# EAGLE design robocon_main_board_2017_rev3 (EAGLE 7.5.0)
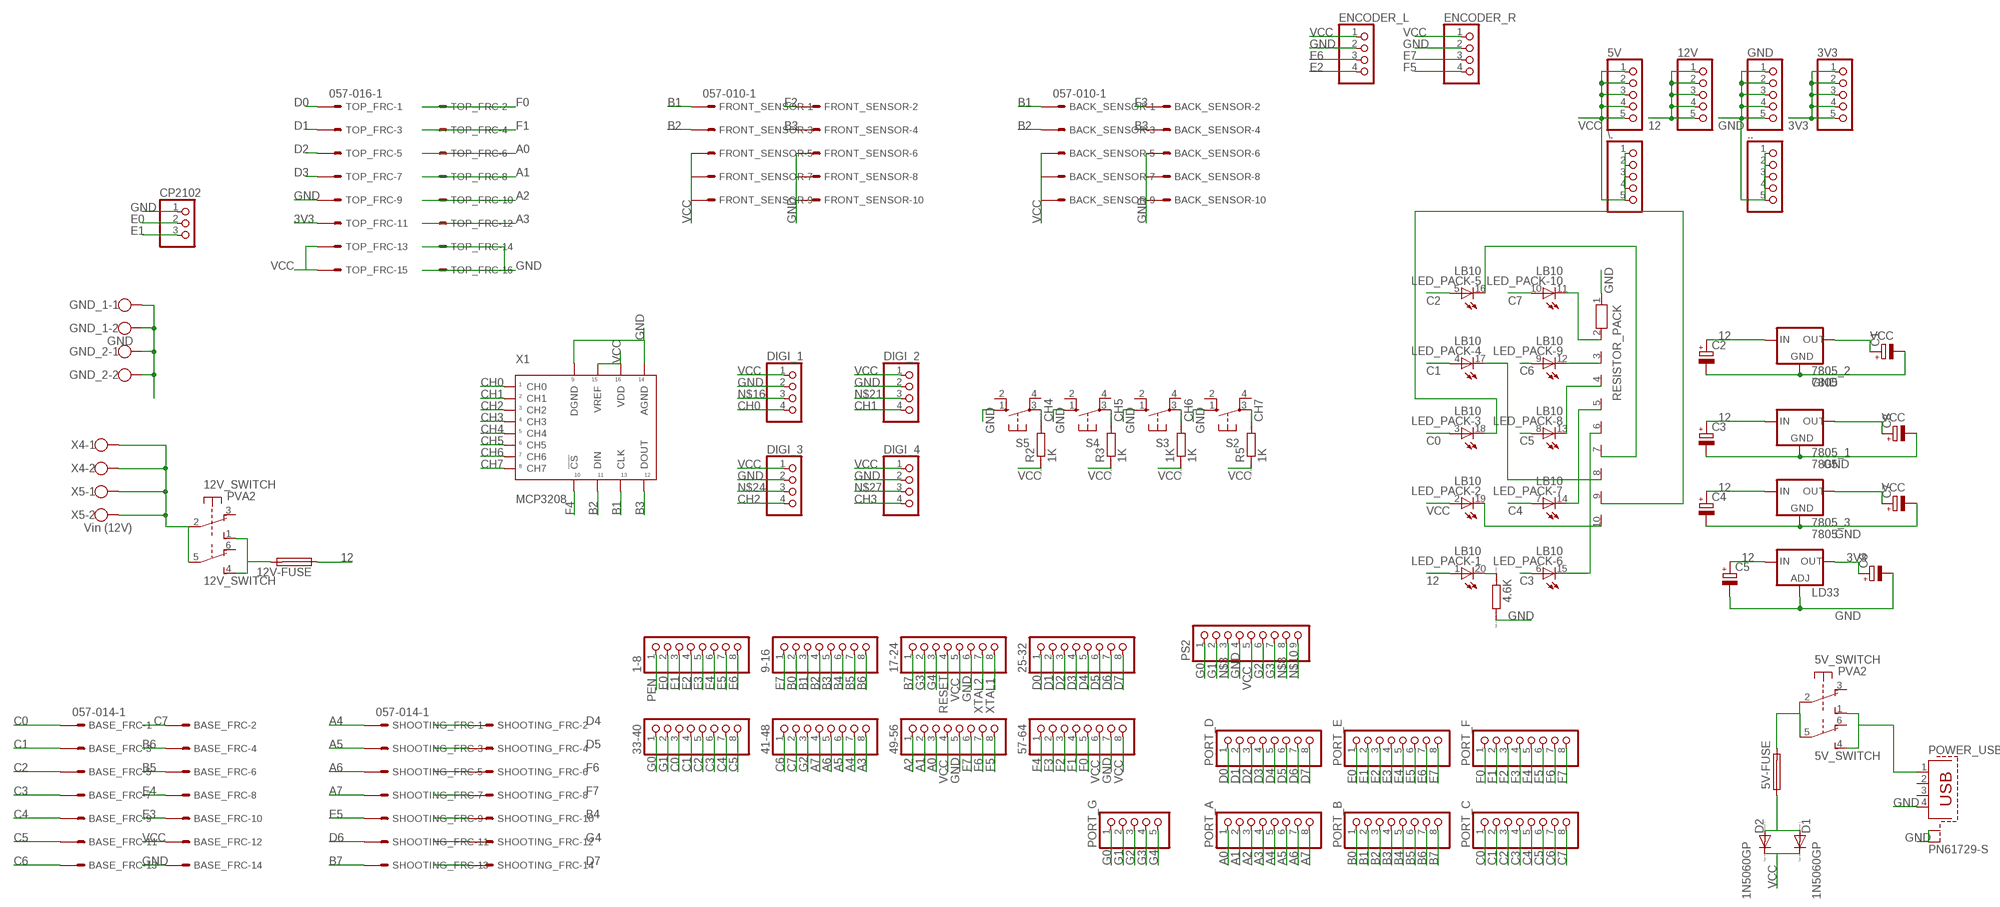
[diagram p0: schematic, sheet 1]

## Parts
1-8  PINHD-1X8  [1X08]
1K  1K  R0204/7  [0204/7]
3V3  PINHD-1X5  [1X05]
4.6K  R0204/7  [0204/7]
5V  PINHD-1X5  [1X05]
5V-FUSE  SH25  [SH25]
5V_SWITCH  PVA2  [PVA2F]
9-16  PINHD-1X8  [1X08]
12V  PINHD-1X5  [1X05]
12V-FUSE  SH25  [SH25]
12V_SWITCH  PVA2  [PVA2F]
17-24  PINHD-1X8  [1X08]
25-32  PINHD-1X8  [1X08]
33-40  PINHD-1X8  [1X08]
41-48  PINHD-1X8  [1X08]
49-56  PINHD-1X8  [1X08]
57-64  PINHD-1X8  [1X08]
7805_1  7805  78XXS  [78XXS]
7805_2  7805  78XXS  [78XXS]
7805_3  7805  78XXS  [78XXS]
..  PINHD-1X5  [1X05]
\.  PINHD-1X5  [1X05]
BACK_SENSOR  057-010-1  [057-010-1]
BASE_FRC  057-014-1  [057-014-1]
C1  CPOL-EUE2.5-5  [E2,5-5]
C2  CPOL-EUE2.5-5  [E2,5-5]
C3  CPOL-EUE2.5-5  [E2,5-5]
C4  CPOL-EUE2.5-5  [E2,5-5]
C5  CPOL-EUE2.5-5  [E2,5-5]
C6  CPOL-EUE2.5-5  [E2,5-5]
C7  CPOL-EUE2.5-5  [E2,5-5]
C8  CPOL-EUE2.5-5  [E2,5-5]
CP2102  PINHD-1X3  [1X03]
D1  1N5060GP  [DO15-12]
D2  1N5060GP  [DO15-12]
DIGI_1  PINHD-1X4  [1X04]
DIGI_2  PINHD-1X4  [1X04]
DIGI_3  PINHD-1X4  [1X04]
DIGI_4  PINHD-1X4  [1X04]
ENCODER_L  PINHD-1X4  [1X04]
ENCODER_R  PINHD-1X4  [1X04]
FRONT_SENSOR  057-010-1  [057-010-1]
GND  PINHD-1X5  [1X05]
GND_1  GND  W237-102  [W237-102]
GND_2  W237-102  [W237-102]
LD33  LM317TS  [317TS]
LED_PACK  LB10  [LB10]
PORT_A  PINHD-1X8  [1X08]
PORT_B  PINHD-1X8  [1X08]
PORT_C  PINHD-1X8  [1X08]
PORT_D  PINHD-1X8  [1X08]
PORT_E  PINHD-1X8  [1X08]
PORT_F  PINHD-1X8  [1X08]
PORT_G  PINHD-1X5  [1X05]
POWER_USB  PN61729-S  [PN61729-S]
PS2  PINHD-1X9  [1X09]
R2  1K  R0204/7  [0204/7]
R3  1K  R0204/7  [0204/7]
R5  1K  R0204/7  [0204/7]
RESISTOR_PACK  RN09  [RN-10]
S2  10-XX  [B3F-10XX]
S3  10-XX  [B3F-10XX]
S4  10-XX  [B3F-10XX]
S5  10-XX  [B3F-10XX]
SHOOTING_FRC  057-014-1  [057-014-1]
TOP_FRC  057-016-1  [057-016-1]
X1  MCP3208  21298EDIP  [DIP16]
X4  W237-102  [W237-102]
X5  Vin (12V)  W237-102  [W237-102]

## Nets
3V3: 3V3.1 3V3.2 3V3.3 3V3.4 3V3.5 C6.+ LD33.2(OUT) TOP_FRC.11
12: 12V-FUSE.1 12V.1 12V.2 12V.3 12V.4 12V.5 7805_1.IN 7805_2.IN 7805_3.IN C2.+ C3.+ C4.+ C5.+ LD33.3(IN) LED_PACK.1(-1:A)
A0: 49-56.3 PORT_A.1 TOP_FRC.6
A1: 49-56.2 PORT_A.2 TOP_FRC.8
A2: 49-56.1 PORT_A.3 TOP_FRC.10
A3: 41-48.8 PORT_A.4 TOP_FRC.12
A4: 41-48.7 PORT_A.5 SHOOTING_FRC.1
A5: 41-48.6 PORT_A.6 SHOOTING_FRC.3
A6: 41-48.5 PORT_A.7 SHOOTING_FRC.5
A7: 41-48.4 PORT_A.8 SHOOTING_FRC.7
B0: 9-16.2 PORT_B.1
B1: 9-16.3 BACK_SENSOR.1 FRONT_SENSOR.1 PORT_B.2 X1.P$13(CLK)
B2: 9-16.4 BACK_SENSOR.3 FRONT_SENSOR.3 PORT_B.3 X1.P$11(DIN)
B3: 9-16.5 BACK_SENSOR.4 FRONT_SENSOR.4 PORT_B.4 X1.P$12(DOUT)
B4: 9-16.6 PORT_B.5 SHOOTING_FRC.10
B5: 9-16.7 BASE_FRC.6 PORT_B.6
B6: 9-16.8 BASE_FRC.4 PORT_B.7
B7: 17-24.1 PORT_B.8 SHOOTING_FRC.13
C0: 33-40.3 BASE_FRC.1 LED_PACK.3(-3:A) PORT_C.1
C1: 33-40.4 BASE_FRC.3 LED_PACK.4(-4:A) PORT_C.2
C2: 33-40.5 BASE_FRC.5 LED_PACK.5(-5:A) PORT_C.3
C3: 33-40.6 BASE_FRC.7 LED_PACK.6(-6:A) PORT_C.4
C4: 33-40.7 BASE_FRC.9 LED_PACK.7(-7:A) PORT_C.5
C5: 33-40.8 BASE_FRC.11 LED_PACK.8(-8:A) PORT_C.6
C6: 41-48.1 BASE_FRC.13 LED_PACK.9(-9:A) PORT_C.7
C7: 41-48.2 BASE_FRC.2 LED_PACK.10(-10:A) PORT_C.8
CH0: DIGI_1.4 X1.P$1(CH0)
CH1: DIGI_2.4 X1.P$2(CH1)
CH2: DIGI_3.4 X1.P$3(CH2)
CH3: DIGI_4.4 X1.P$4(CH3)
CH4: R2.2 S5.3(P) X1.P$5(CH4)
CH5: R3.2 S4.3(P) X1.P$6(CH5)
CH6: 1K.2 S3.3(P) X1.P$7(CH6)
CH7: R5.2 S2.3(P) X1.P$8(CH7)
D0: 25-32.1 PORT_D.1 TOP_FRC.1
D1: 25-32.2 PORT_D.2 TOP_FRC.3
D2: 25-32.3 PORT_D.3 TOP_FRC.5
D3: 25-32.4 PORT_D.4 TOP_FRC.7
D4: 25-32.5 PORT_D.5 SHOOTING_FRC.2
D5: 25-32.6 PORT_D.6 SHOOTING_FRC.4
D6: 25-32.7 PORT_D.7 SHOOTING_FRC.11
D7: 25-32.8 PORT_D.8 SHOOTING_FRC.14
E0: 1-8.2 CP2102.2 PORT_E.1
E1: 1-8.3 CP2102.3 PORT_E.2
E2: 1-8.4 ENCODER_L.4 PORT_E.3
E3: 1-8.5 BASE_FRC.10 PORT_E.4
E4: 1-8.6 BASE_FRC.8 PORT_E.5
E5: 1-8.7 PORT_E.6 SHOOTING_FRC.9
E6: 1-8.8 ENCODER_L.3 PORT_E.7
E7: 9-16.1 ENCODER_R.3 PORT_E.8
F0: 57-64.5 PORT_F.1 TOP_FRC.2
F1: 57-64.4 PORT_F.2 TOP_FRC.4
F2: 57-64.3 FRONT_SENSOR.2 PORT_F.3
F3: 57-64.2 BACK_SENSOR.2 PORT_F.4
F4: 57-64.1 PORT_F.5 X1.P$10(!CS)
F5: 49-56.8 ENCODER_R.4 PORT_F.6
F6: 49-56.7 PORT_F.7 SHOOTING_FRC.6
F7: 49-56.6 PORT_F.8 SHOOTING_FRC.8
G0: 33-40.1 PORT_G.1 PS2.1
G1: 33-40.2 PORT_G.2 PS2.2
G2: 41-48.3 PORT_G.3 PS2.6
G3: 17-24.2 PORT_G.4 PS2.7
G4: 17-24.3 PORT_G.5 SHOOTING_FRC.12
GND: 4.6K.2 17-24.6 49-56.5 57-64.7 7805_1.GND 7805_2.GND 7805_3.GND ...1 ...2 ...3 ...4 ...5 BACK_SENSOR.6 BACK_SENSOR.8 BACK_SENSOR.10 BASE_FRC.14 C1.- C2.- C3.- C4.- C5.- C6.- C7.- C8.- CP2102.1 DIGI_1.2 DIGI_2.2 DIGI_3.2 DIGI_4.2 ENCODER_L.2 ENCODER_R.2 FRONT_SENSOR.6 FRONT_SENSOR.8 FRONT_SENSOR.10 GND.1 GND.2 GND.3 GND.4 GND.5 GND_1.1 GND_1.2 GND_2.1 GND_2.2 LD33.1(ADJ) POWER_USB.4 POWER_USB.S1 POWER_USB.S2 PS2.4 RESISTOR_PACK.1 S2.1(S) S3.1(S) S4.1(S) S5.1(S) TOP_FRC.9 TOP_FRC.14 TOP_FRC.16 X1.P$9(DGND) X1.P$14(AGND)
N$1: LED_PACK.11(-10:C) RESISTOR_PACK.2
N$2: LED_PACK.12(-9:C) RESISTOR_PACK.3
N$3: PS2.3
N$4: LED_PACK.13(-8:C) RESISTOR_PACK.4
N$5: LED_PACK.14(-7:C) RESISTOR_PACK.5
N$6: LED_PACK.15(-6:C) RESISTOR_PACK.6
N$7: LED_PACK.16(-5:C) RESISTOR_PACK.7
N$8: PS2.8
N$9: LED_PACK.17(-4:C) RESISTOR_PACK.8
N$10: PS2.9
N$11: LED_PACK.18(-3:C) RESISTOR_PACK.9
N$12: LED_PACK.19(-2:C) RESISTOR_PACK.10
N$13: 4.6K.1 LED_PACK.20(-1:C)
N$14: 5V_SWITCH.1(1:S) 5V_SWITCH.4(2:S) POWER_USB.1
N$15: 5V-FUSE.2 5V_SWITCH.2(1:P) 5V_SWITCH.5(2:P)
N$16: DIGI_1.3
N$17: 12V_SWITCH.2(1:P) 12V_SWITCH.5(2:P) X4.1 X4.2 X5.1 X5.2
N$18: 12V-FUSE.2 12V_SWITCH.1(1:S) 12V_SWITCH.4(2:S)
N$19: 5V-FUSE.1 D1.A D2.A
N$21: DIGI_2.3
N$24: DIGI_3.3
N$27: DIGI_4.3
PEN: 1-8.1
RESET: 17-24.4
VCC: 1K.1 5V.1 5V.2 5V.3 5V.4 5V.5 17-24.5 49-56.4 57-64.6 57-64.8 7805_1.OUT 7805_2.OUT 7805_3.OUT \..1 \..2 \..3 \..4 \..5 BACK_SENSOR.5 BACK_SENSOR.7 BACK_SENSOR.9 BASE_FRC.12 C1.+ C7.+ C8.+ D1.C D2.C DIGI_1.1 DIGI_2.1 DIGI_3.1 DIGI_4.1 ENCODER_L.1 ENCODER_R.1 FRONT_SENSOR.5 FRONT_SENSOR.7 FRONT_SENSOR.9 LED_PACK.2(-2:A) PS2.5 R2.1 R3.1 R5.1 TOP_FRC.13 TOP_FRC.15 X1.P$15(VREF) X1.P$16(VDD)
XTAL1: 17-24.8
XTAL2: 17-24.7
Unconnected: 5V_SWITCH.3(1:O) 5V_SWITCH.6(2:O) 12V_SWITCH.3(1:O) 12V_SWITCH.6(2:O) POWER_USB.2 POWER_USB.3 S2.2(S1) S2.4(P1) S3.2(S1) S3.4(P1) S4.2(S1) S4.4(P1) S5.2(S1) S5.4(P1)

## Library data of the parts
1-8 9-16 17-24 25-32 33-40 41-48 49-56 57-64 PORT_A PORT_B PORT_C PORT_D PORT_E PORT_F = pinhead:PINHD-1X8: PIN HEADER
1K 4.6K R2 R3 R5 = eagle-ltspice:R: RESISTOR, European symbol; SPICEMODEL: NONE; SPICEPREFIX: R
3V3 5V 12V .. \. GND PORT_G = pinhead:PINHD-1X5: PIN HEADER
5V-FUSE 12V-FUSE = fuse:SH25: FUSE HOLDER grid 25 mm, OGN0031 8211, Schurter (Buerklin); MF: SCHURTER; MPN: 0031.8211; OC_FARNELL: 1162741; OC_NEWARK: 96B9380
5V_SWITCH 12V_SWITCH = switch-misc:PVA2: ITT SWITCH
7805_1-7805_3 = v-reg:78XXS: VOLTAGE REGULATOR
BACK_SENSOR FRONT_SENSOR = con-panduit:057-010-: CONNECTOR 10-pin series 057 contact pc board low profile headers; OC_FARNELL: unknown; OC_NEWARK: unknown
BASE_FRC SHOOTING_FRC = con-panduit:057-014-: CONNECTOR 10-pin series 057 contact pc board low profile headers; OC_FARNELL: unknown; OC_NEWARK: unknown
C1-C8 = rcl:CPOL-EU: POLARIZED CAPACITOR, European symbol
CP2102 = pinhead:PINHD-1X3: PIN HEADER
D1 D2 = diode:1N5060GP: DIODE controlled avalanche rectifier
DIGI_1-DIGI_4 ENCODER_L ENCODER_R = pinhead:PINHD-1X4: PIN HEADER
GND_1 GND_2 X4 X5 = con-wago-500:W237-102: WAGO SCREW CLAMP; MPN: 237-102; OC_FARNELL: unknown; OC_NEWARK: 70K9898
LD33 = v-reg:LM317TS: VOLTAGE REGULATOR
LED_PACK = led:LB10: LED BLOCK 10-LED bar graph, DIL, Siemens
POWER_USB = con-berg:PN61729-S: BERG USB connector; OC_FARNELL: unknown; OC_NEWARK: unknown
PS2 = pinhead:PINHD-1X9: PIN HEADER
RESISTOR_PACK = resistor-net:RN09: RESISTOR NETWORK; OC_FARNELL: unknown; OC_NEWARK: unknown
S2-S5 = switch-omron:10-XX: OMRON SWITCH; MPN: B3F-1000; OC_FARNELL: 176432; OC_NEWARK: 36M3542
TOP_FRC = con-panduit:057-016-: CONNECTOR 10-pin series 057 contact pc board low profile headers; OC_FARNELL: unknown; OC_NEWARK: unknown
X1 = Microchip:21298E

## Board
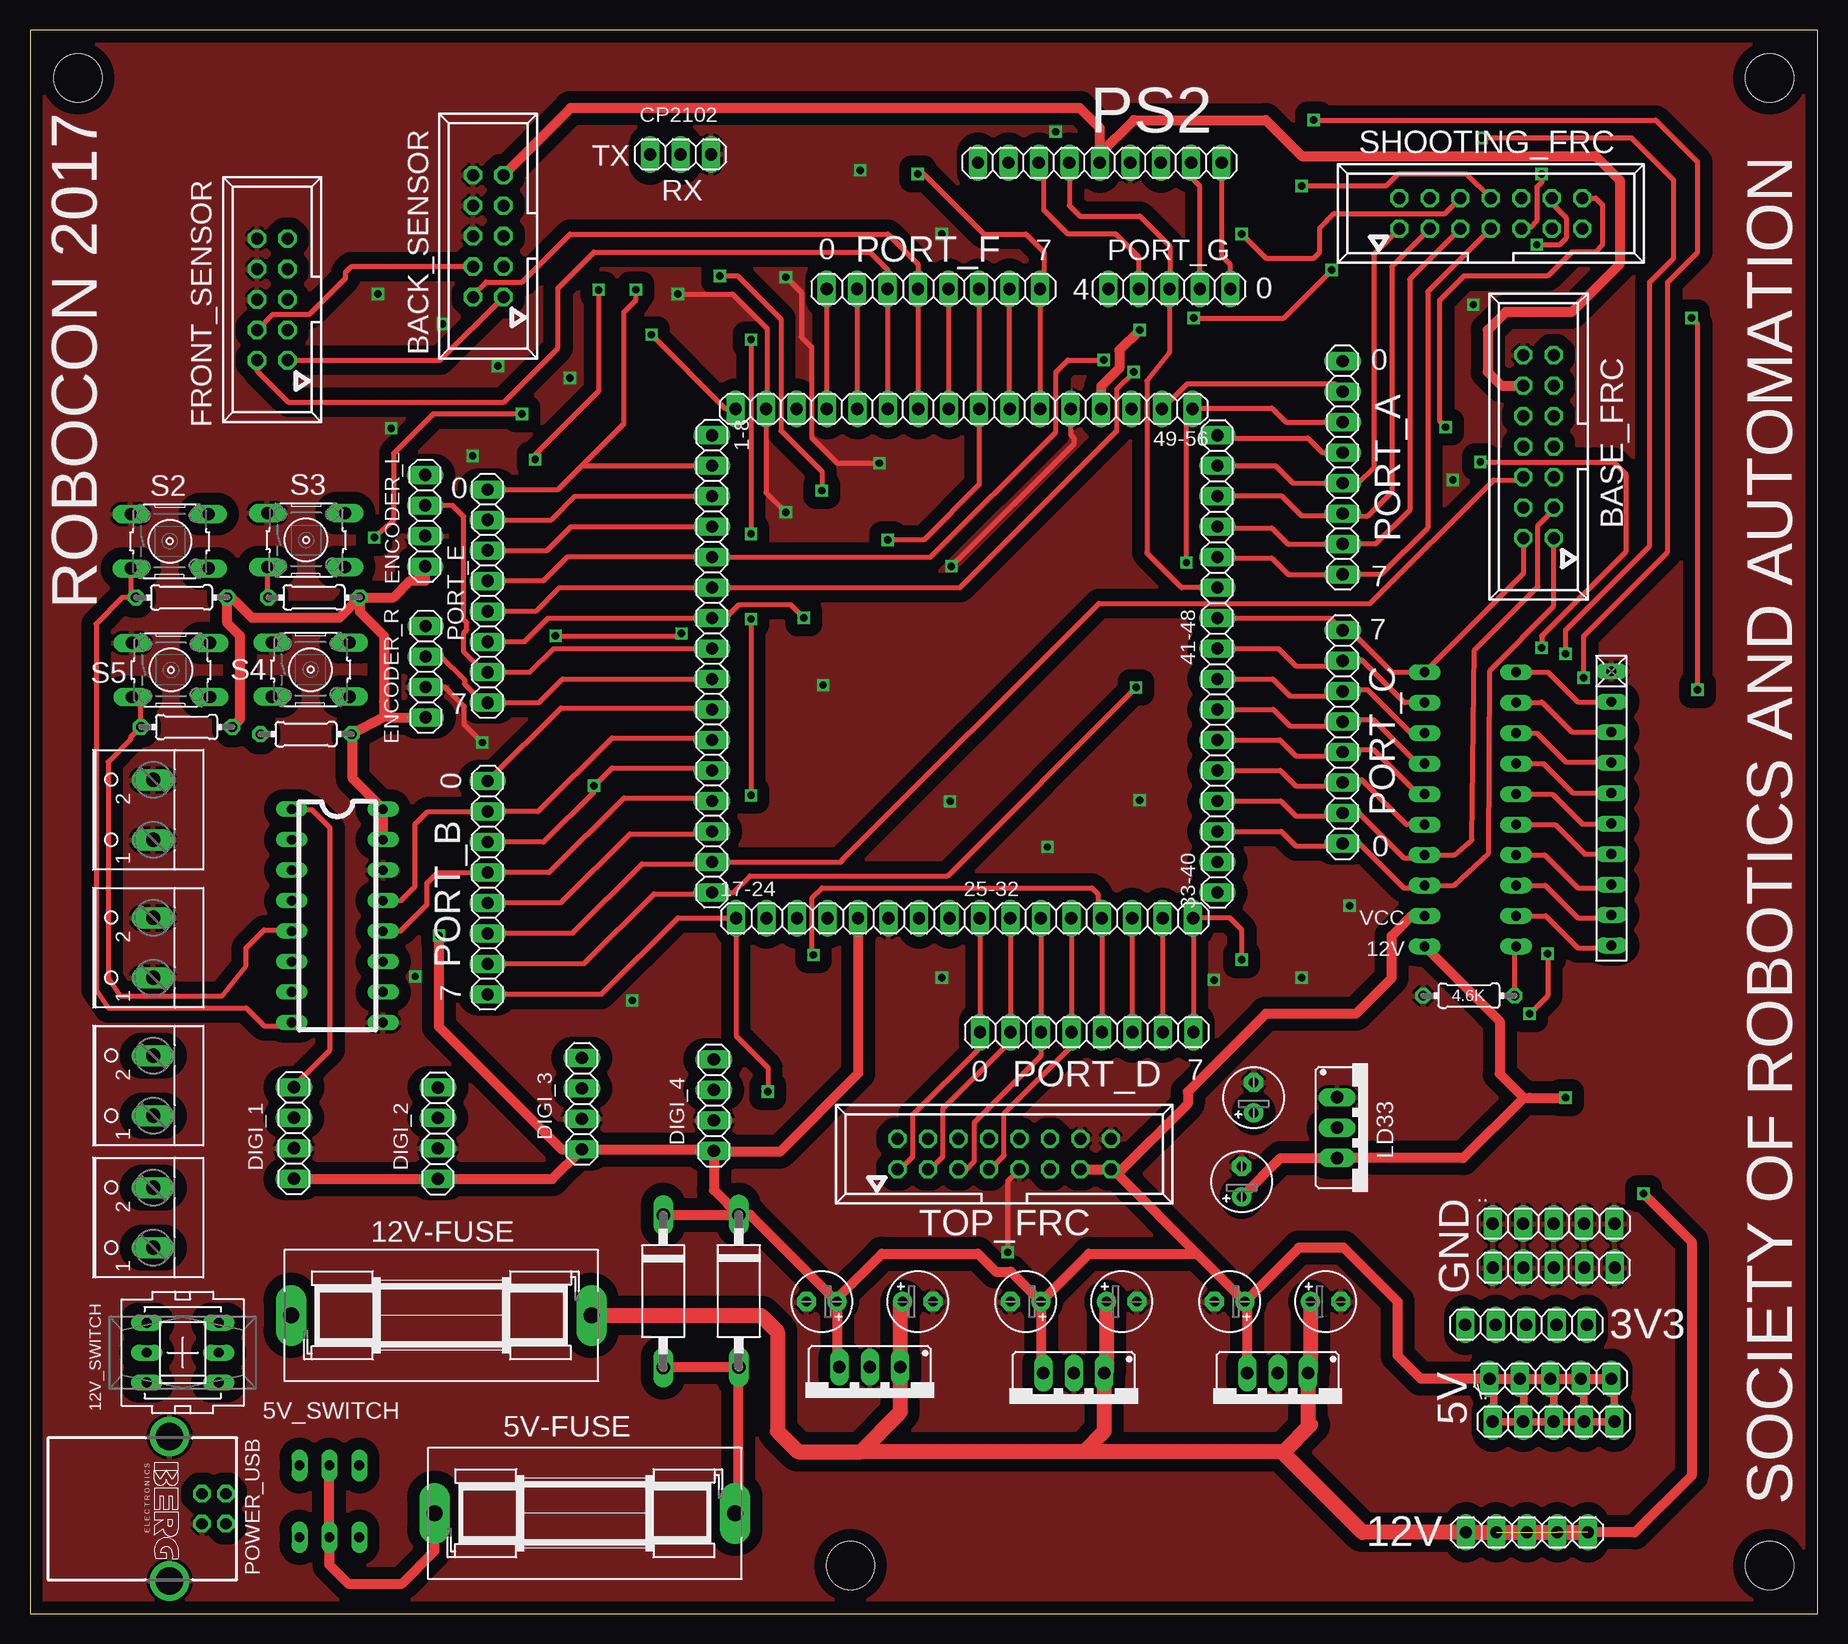
[diagram p1: board, top side]
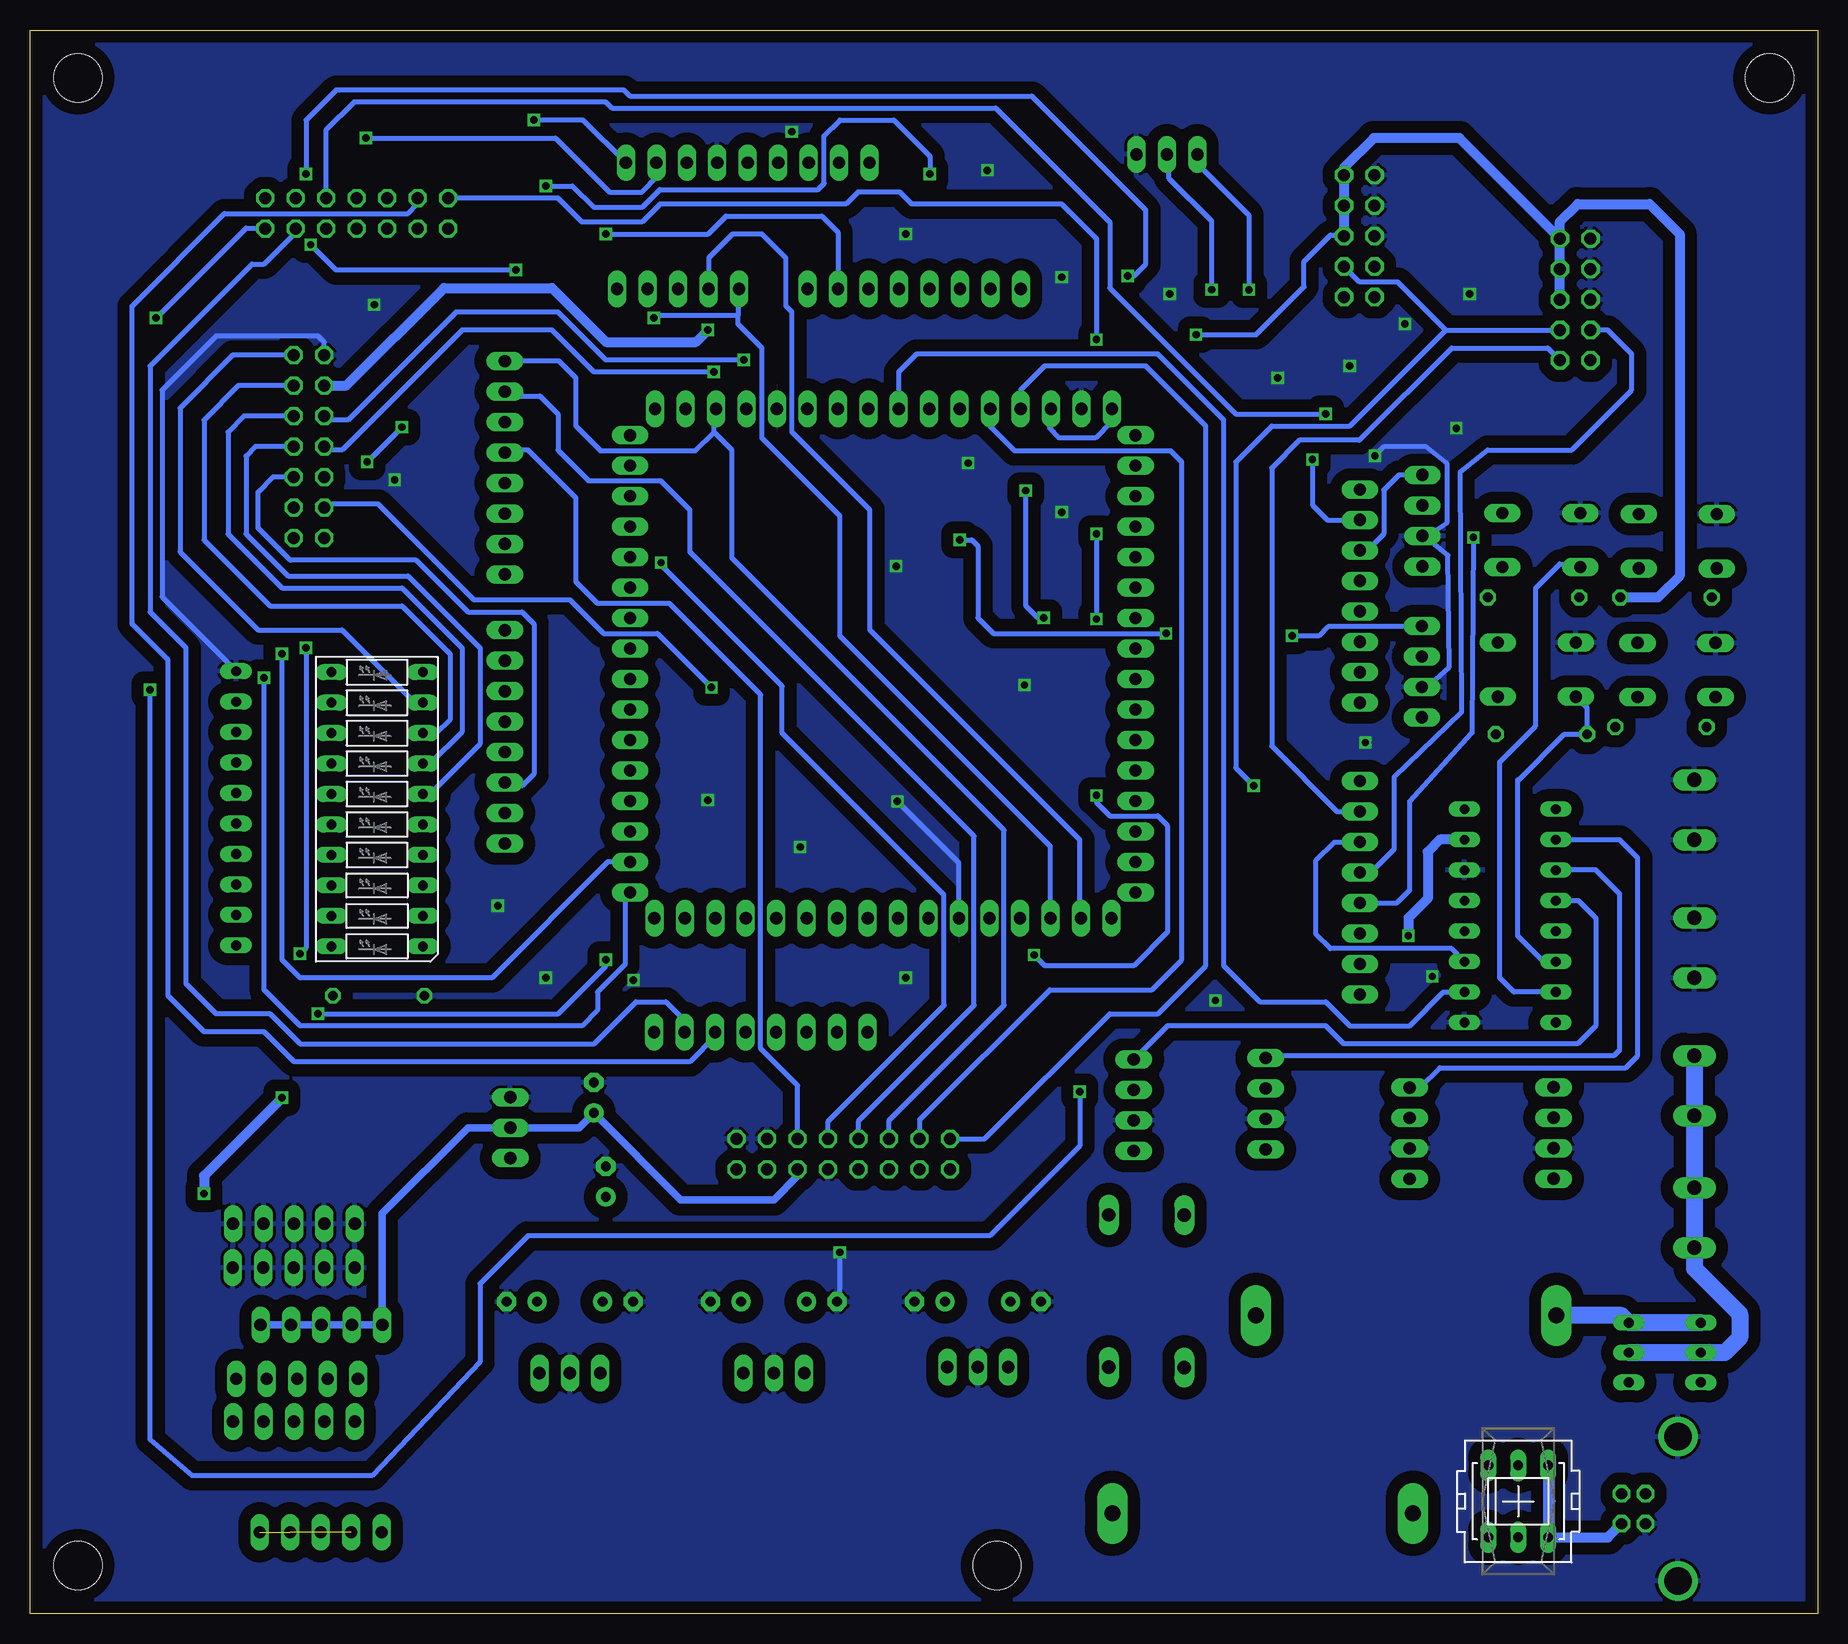
[diagram p2: board, bottom side, seen from below]

Size 149 x 132 mm. Coordinates in mm from the lower left corner, seen from the top.
Outline: 0,132 0,0 149,0 149,132 0,132
Copper layers (1*16): Top 0.035mm / dielectric 1.5mm / Bottom 0.035mm
Design rules "default *": minimum track width 10mil, minimum drill 24mil, track to track 16mil, track to pad 10mil, pad to pad 12mil, via to via 10mil, smd to smd 8mil, copper to edge 40mil, drill to drill 8mil, minimum pad ring 10mil, minimum via ring 8mil, stop-mask expansion 4mil, vias tented up to drill 0mil, thermal gap 10mil
Holes 4 mm at 145,4 145,128 4,128 68.4,4

### Footprints (pad centres in the part's own frame; a part is rotated, then mirrored left to right if it is on the bottom)
1X08 = drill 1.016 long: 1 -8.89,0; 2 -6.35,0; 3 -3.81,0; 4 -1.27,0; 5 1.27,0; 6 3.81,0; 7 6.35,0; 8 8.89,0
0204/7 = drill 0.813 octagon: 1 -3.81,0; 2 3.81,0
1X05 = drill 1.016 long: 1 -5.08,0; 2 -2.54,0; 3 0,0; 4 2.54,0; 5 5.08,0
SH25 = drill 1.321 pad 2.54 long: 1 -12.522,0; 2 12.522,0
PVA2F = drill 0.813 long: 1 -2.997,2.489; 2 -2.997,0; 3 -2.997,-2.489; 4 2.997,2.489; 5 2.997,0; 6 2.997,-2.489
78XXS = drill 1.016 long: GND 0,-2.54; IN -2.54,-2.54; OUT 2.54,-2.54
057-010-1 = drill 1 octagon: 1 -5.08,-1.27; 2 -5.08,1.27; 3 -2.54,-1.27; 4 -2.54,1.27; 5 0,-1.27; 6 0,1.27; 7 2.54,-1.27; 8 2.54,1.27; 9 5.08,-1.27; 10 5.08,1.27
057-014-1 = drill 1 octagon: 1 -7.62,-1.27; 2 -7.62,1.27; 3 -5.08,-1.27; 4 -5.08,1.27; 5 -2.54,-1.27; 6 -2.54,1.27; 7 0,-1.27; 8 0,1.27; 9 2.54,-1.27; 10 2.54,1.27; 11 5.08,-1.27; 12 5.08,1.27; 13 7.62,-1.27; 14 7.62,1.27
E2,5-5 = drill 0.813 pad 1.6: + -1.27,0 | drill 0.813 pad 1.6 octagon: - 1.27,0
1X03 = drill 1.016 long: 1 -2.54,0; 2 0,0; 3 2.54,0
DO15-12 = drill 1.118 long: A 6.35,0; C -6.35,0
1X04 = drill 1.016 long: 1 -3.81,0; 2 -1.27,0; 3 1.27,0; 4 3.81,0
W237-102 = drill 1.194 long: 1 -2.5,-1.27; 2 2.5,-1.27
317TS = drill 1.016 long: 1 -2.54,-2.54; 2 0,-2.54; 3 2.54,-2.54
LB10 = drill 0.813 long: 1 -11.43,-3.81; 2 -8.89,-3.81; 3 -6.35,-3.81; 4 -3.81,-3.81; 5 -1.27,-3.81; 6 1.27,-3.81; 7 3.81,-3.81; 8 6.35,-3.81; 9 8.89,-3.81; 10 11.43,-3.81; 11 11.43,3.81; 12 8.89,3.81; 13 6.35,3.81; 14 3.81,3.81; 15 1.27,3.81; 16 -1.27,3.81; 17 -3.81,3.81; 18 -6.35,3.81; 19 -8.89,3.81; 20 -11.43,3.81
PN61729-S = drill 0.95 octagon: 1 1.25,4.71; 2 -1.25,4.71; 3 -1.25,2.71; 4 1.25,2.71 | drill 2.3 pad 2.9: S1 -6.02,0; S2 6.02,0
1X09 = drill 1.016 long: 1 -10.16,0; 2 -7.62,0; 3 -5.08,0; 4 -2.54,0; 5 0,0; 6 2.54,0; 7 5.08,0; 8 7.62,0; 9 10.16,0
RN-10 = drill 0.813 long: 1 -11.43,0; 2 -8.89,0; 3 -6.35,0; 4 -3.81,0; 5 -1.27,0; 6 1.27,0; 7 3.81,0; 8 6.35,0; 9 8.89,0; 10 11.43,0
B3F-10XX = drill 1.016 long: 1 -3.251,2.261; 2 3.251,2.261; 3 -3.251,-2.261; 4 3.251,-2.261
057-016-1 = drill 1 octagon: 1 -8.89,-1.27; 2 -8.89,1.27; 3 -6.35,-1.27; 4 -6.35,1.27; 5 -3.81,-1.27; 6 -3.81,1.27; 7 -1.27,-1.27; 8 -1.27,1.27; 9 1.27,-1.27; 10 1.27,1.27; 11 3.81,-1.27; 12 3.81,1.27; 13 6.35,-1.27; 14 6.35,1.27; 15 8.89,-1.27; 16 8.89,1.27
DIP16 = drill 0.8 long: P$1 -10.16,-3.81; P$2 -7.62,-3.81; P$3 -5.08,-3.81; P$4 -2.54,-3.81; P$5 0,-3.81; P$6 2.54,-3.81; P$7 5.08,-3.81; P$8 7.62,-3.81; P$9 7.62,3.81; P$10 5.08,3.81; P$11 2.54,3.81; P$12 0,3.81; P$13 -2.54,3.81; P$14 -5.08,3.81; P$15 -7.62,3.81; P$16 -10.16,3.81

### Placement (x,y rotation side)
1-8  56.84,89.33 270 top
1K  23.67,84.7 180 top
3V3  124.71,24.07 0 top
4.6K  119.94,51.5 180 top
5V  126.74,19.57 0 top
5V-FUSE  46.25,8.35 180 top
5V_SWITCH  24.95,9.35 270 bottom
9-16  56.84,69.01 270 top
12V  124.77,6.77 0 top
12V-FUSE  34.29,24.85 180 top
12V_SWITCH  12.73,21.75 0 top
17-24  67.75,57.96 0 top
25-32  88.06,57.96 0 top
33-40  98.97,69.01 90 top
41-48  98.97,89.33 90 top
49-56  88.01,100.42 180 top
57-64  67.69,100.42 180 top
7805_1  70,18 180 top
7805_2  87,17.5 180 top
7805_3  104,17.5 180 top
..  127,32.5 0 top
\.  127,16 0 top
BACK_SENSOR  38.19,114.83 90 top
BASE_FRC  125.74,97.28 90 top
C1  66,26 180 top
C2  74,26 0 top
C3  101,36 90 top
C4  91,26 0 top
C5  108,26 0 top
C6  102,43 90 top
C7  100,26 180 top
C8  83,26 180 top
CP2102  54.23,121.63 180 top
D1  59.08,26.88 270 top
D2  52.78,26.86 270 top
DIGI_1  22,40.06 90 top
DIGI_2  34,40.03 90 top
DIGI_3  46,42.5 90 top
DIGI_4  57,42.37 90 top
ENCODER_L  32.93,91.1 90 top
ENCODER_R  32.98,78.51 90 top
FRONT_SENSOR  20.19,109.54 90 top
GND  127.02,28.83 180 top
GND_1  9,67 90 top
GND_2  9,55.5 90 top
LD33  111.5,40.5 270 top
LED_PACK  120.07,67.04 90 bottom
PORT_A  109.42,95.51 270 top
PORT_B  38.14,60.5 270 top
PORT_C  109.42,73.07 90 top
PORT_D  88.08,48.46 0 top
PORT_E  38.14,84.81 270 top
PORT_F  75.3,110.42 0 top
PORT_G  94.97,110.41 180 top
POWER_USB  11.63,8.73 270 top
PS2  89.17,120.93 180 top
R2  13.05,73.9 180 top
R3  23.01,73.3 180 top
R5  12.63,84.7 180 top
RESISTOR_PACK  131.82,67.12 270 top
S2  11.65,89.38 0 top
S3  23.02,89.48 0 top
S4  23.39,78.68 0 top
S5  11.75,78.65 0 top
SHOOTING_FRC  121.76,116.71 0 top
TOP_FRC  81.2,38.3 0 top
X1  25.62,56.89 270 top
X4  9,44 90 top
X5  9,33 90 top

### Tracks (layer width: path | path; a pad name or v marks a point on that pad's centre or on a via)
3V3
  Bottom 0.61: 3V3.5 3V3.4 3V3.3 3V3.2 3V3.1 119.63,33.37 112.5,40.5 LD33.2 103.23,40.5 C6.+ 94.77,34.5 87,34.5 85.01,36.49 TOP_FRC.11
12  (via drill 0.6)  (3 unrouted)
  Top 0.813: LED_PACK.1 122.5,49.37 122.5,45 124.5,43 | v128,43 125,43 124.5,43 | v134.5,35 138.5,31 138.5,11.5 133.77,6.77 12V.5 | C3.+ 104.23,37.96 LD33.3 119.46,37.96 124.5,43
  Top 1.27: 12V-FUSE.1 60.95,24.85 62.3,23.5 62.3,15.2 64,13.5 69.25,13.5 | 69.25,13.5 72.54,16.79 7805_1.IN 72.54,26 C2.+ | 87.85,13.5 89.54,15.19 7805_2.IN 89.73,20.23 C4.+ | 87.85,13.5 69.25,13.5 | 104.35,13.5 104.5,13.5 106.74,15.74 106.54,15.94 7805_3.IN 106.73,20.23 C5.+ arc-45 106.74,25.98 | 104.35,13.5 87.85,13.5 | 104.35,13.5 111.08,6.77 12V.1 12V.5
  Bottom 0.813: v128,43 134.5,36.5 v134.5,35
A0
  Bottom 0.406: 92,98.5 93.6,96.9 101.4,96.9 103.5,99 103.5,103 104.9,104.4 PORT_A.1 | 92,98.5 92,100.24 49-56.3 | TOP_FRC.6 77.39,41.11 67.8,50.7 67.8,65.3 90.5,88 90.5,97 92,98.5
A1
  Top 0.406: 49-56.2 96.45,102.5 108.78,102.5 PORT_A.2
  Bottom 0.406: TOP_FRC.8 79.93,41.07 70.3,50.7 70.3,64.8 94,88.5 94,92 96.4,94.4 102.4,94.4 105,97 105,100 106.5,101.5 109,101.5 109.36,101.86 PORT_A.2
A2  (via drill 0.6)
  Top 0.406: v96.4,87.6 96.4,99.91 49-56.1 96.99,100.5 103.5,100.5 104.68,99.32 PORT_A.3
  Bottom 0.406: TOP_FRC.10 82.47,41.03 72.8,50.7 72.83,50.73 72.83,59.91 86.3,73.38 86.3,77.3 96.4,87.4 v96.4,87.6
A3
  Top 0.406: 41-48.8 99.19,98 106.5,98 107.72,96.78 PORT_A.4
  Bottom 0.406: TOP_FRC.12 85.01,44.01 88.1,47.1 88.1,76.6 95.7,84.2 101.7,84.2 103.5,86 103.5,93 107.5,97 109.2,97 PORT_A.4
A4
  Top 0.406: 41-48.7 103.82,95.68 105.26,94.24 PORT_A.5 110.74,94.24 112,95.5 112,113.3 SHOOTING_FRC.1
A5
  Top 0.406: SHOOTING_FRC.3 113.5,112.26 113.5,93.5 111.5,91.5 109.62,91.5 PORT_A.6 109.22,91.5 106,91.5 104.36,93.14 41-48.6
A6
  Top 0.406: SHOOTING_FRC.5 115,111.22 115,92 112.16,89.16 PORT_A.7 104.84,89.16 103.5,90.5 99.07,90.5 41-48.5
A7
  Top 0.406: SHOOTING_FRC.7 116.5,110.18 116.5,90.5 112.62,86.62 PORT_A.8 104.88,86.62 103.5,88 99.03,88 41-48.4
B0
  Top 0.406: 9-16.2 56.7,75.5 44.25,75.5 PORT_B.1
B1
  Top 0.406: X1.P$13 30.93,59.43 32.1,60.6 32.1,65.8 33.15,66.85 PORT_B.2 42.35,66.85 48.5,73 56.66,73 9-16.3 | FRONT_SENSOR.1 34.17,104.46 BACK_SENSOR.1
  Bottom 0.406: FRONT_SENSOR.1 22.5,105.5 30.5,105.5 38.2,97.8 43.2,97.8 45.5,95.5 45.5,72.3 40.05,66.85 PORT_B.2
B2  (via drill 0.6)
  Top 0.406: 9-16.4 56.62,70.5 48.5,70.5 v47,69 47,68.5 42.81,64.31 PORT_B.3
  Bottom 0.406: 31,107 39,99 45.5,99 48.5,96 48.5,70.5 v47,69 | 31,107 FRONT_SENSOR.3 | 31,107 35,111 38.17,111 BACK_SENSOR.3 | X1.P$11 30.5,55.42 40.62,55.42 41.8,56.6 41.8,62.8 40.29,64.31 PORT_B.3
B3
  Top 0.406: 9-16.5 56.58,68 49.5,68 43.27,61.77 PORT_B.4 33.97,61.77 33.1,60.9 33.1,59.1 30.89,56.89 X1.P$12 | BACK_SENSOR.4 26.79,112.29 26.3,111.8 26.3,111.3 23.3,108.3 20.22,108.3 FRONT_SENSOR.4
  Bottom 0.406: FRONT_SENSOR.4 17.5,107 15.5,105 15.5,102 20.5,97 27.5,97 29.8,95.12 29.7,75.1 35.3,69.7 35.3,63.7 37.23,61.77 PORT_B.4
B4  (via drill 0.6)
  Top 0.406: 9-16.6 56.65,65 50,65 44.23,59.23 PORT_B.5 | v41,100 33.6,100 30.3,96.7 30.3,91.1 v28.7,89.7
  Bottom 0.406: SHOOTING_FRC.10 124.3,123.7 122,126 101,126 100.5,125.5 68.5,125.5 59,116 59,110.5 48.5,100 v41,100 | PORT_B.5 35.07,59.23 34,60.3 34,67.7 28.8,73.4 v28.7,89.7
B5
  Top 0.406: BASE_FRC.6 124.23,94.5 122,94.5 111.7,84.2 89.1,84.2 67.66,62.76 67.66,62.66 9-16.7 56.69,62.5 51,62.5 45.19,56.69 PORT_B.6
B6  (via drill 0.6)
  Top 0.406: v92.2,77.2 76.5,61.5 60,61.5 58.62,60.12 9-16.8 56.73,60 52,60 46.15,54.15 PORT_B.7
  Bottom 0.406: BASE_FRC.4 124.17,92.5 120,92.5 112,84.5 104,84.5 101.2,81.7 96.7,81.7 v92.2,77.2
B7  (via drill 0.6)
  Top 0.406: v61.5,43.5 61.5,45.5 58.86,48.14 17-24.1 58.82,58 54,58 47.61,51.61 PORT_B.8 | v139,77 139,107.5 v138.5,108
  Bottom 0.406: v61.5,43.5 61.5,39 69,31.5 107.5,31.5 111.5,27.5 111.5,21 120.5,11.5 135.5,11.5 139,14.5 v139,77 | v138.5,108 131,115.5 129.44,115.5 SHOOTING_FRC.13
C0
  Top 0.406: 33-40.3 104.3,65.2 105.5,64 109.24,64 PORT_C.1 110.82,64.18 114.5,60.5 116.07,60.5 LED_PACK.3 118.69,60.69 121.6,63.4 121.7,78.6 127,84 127,87.15 BASE_FRC.1
C1
  Top 0.406: 33-40.4 104.26,67.74 105.5,66.5 109.2,66.5 PORT_C.2 110.78,66.72 114.5,63 116.03,63 LED_PACK.4 118.73,63.23 120.2,64.5 120.4,80.3 125.7,85.6 125.7,90.7 127.01,92.01 BASE_FRC.3
C2
  Top 0.406: 33-40.5 104.22,70.28 105.5,69 109.16,69 PORT_C.3 109.66,69.5 111,69.5 114.73,65.77 LED_PACK.5
  Bottom 0.406: BASE_FRC.5 128.76,94.74 130,93.5 130,90.5 127.3,87.8 116.8,87.8 112.5,83.5 108,83.5 107,82.5 107,70 108,69 109.16,69 PORT_C.3
C3
  Top 0.406: 33-40.6 104.18,72.82 105.5,71.5 109.12,71.5 PORT_C.4 109.62,72 112,72 115.69,68.31 LED_PACK.6
  Bottom 0.406: BASE_FRC.7 130.22,97.28 131,96.5 131,90 127.5,86.5 117.5,86.5 111.5,80.5 111.5,72.5 115.5,68.5 116.07,68.5 LED_PACK.6
C4
  Top 0.406: 33-40.7 103.64,75.36 105,74 109.08,74 PORT_C.5 109.58,74.5 112,74.5 115.65,70.85 LED_PACK.7
  Bottom 0.406: BASE_FRC.9 131.18,99.82 132.5,98.5 132.5,90 128,85.5 118,85.5 113,80.5 113,73.5 115.65,70.85 LED_PACK.7
C5
  Top 0.406: 33-40.8 103.6,77.9 105,76.5 109.04,76.5 PORT_C.6 109.54,77 111.5,77 115.11,73.39 LED_PACK.8
  Bottom 0.406: BASE_FRC.11 131.64,102.36 134.5,99.5 134.5,89.5 129,84 118,84 114,80 114,74.5 115.11,73.39 LED_PACK.8
C6
  Top 0.406: 41-48.1 104.06,80.44 105.5,79 109,79 PORT_C.7 109.5,79.5 111,79.5 114.57,75.93 LED_PACK.9
  Bottom 0.406: LED_PACK.9 116.33,76 117,76 123,82 130,82 136.5,88.5 136.5,100.5 132.1,104.9 BASE_FRC.13
C7
  Top 0.406: 41-48.2 108.4,82.98 PORT_C.8 110.04,81.96 113.5,78.5 116.23,78.5 LED_PACK.10 124.47,86.68 BASE_FRC.2
CH0
  Top 0.406: X1.P$1 21.86,67 23.5,67 25,65.5 25,47 22,44 DIGI_1.4
CH1
  Bottom 0.406: DIGI_2.4 33.16,43.84 31.5,45.5 16,45.5 15,46.5 15,63 16.5,64.5 X1.P$2
CH2
  Bottom 0.406: X1.P$3 21.78,62 18.5,62 16.5,60 16.5,47 17,46.5 45.81,46.5 DIGI_3.4
CH3
  Bottom 0.406: X1.P$4 19.93,59.43 18.5,58 18.5,49 20,47.5 39.5,47.5 41,49 54.18,49 DIGI_4.4
CH4
  Top 0.406: X1.P$5 21.7,57 19.5,57 18,55.5 18,54 16,51.5 7.5,51.5 6.5,53 6.5,71 8.4,72.9 8.4,73.06 R2.2 9.24,75.65 S5.3
CH5
  Bottom 0.406: X1.P$6 22.85,54.35 25,56.5 25,69.5 24.9,69.5 21.1,73.3 R3.2 19.2,75.48 S4.3
CH6
  Top 0.406: S3.3 19.77,84.79 1K.2
  Bottom 0.406: X1.P$7 25.31,51.81 26.5,53 26.5,71 23.5,74 23.5,85.5 21.5,87.5 20.05,87.5 S3.3
CH7
  Top 0.406: S2.3 8.4,85.12 R5.2 7.7,84.7 5.5,82.5 5.5,52 6.5,50.5 18,50.5 19.5,49 21.54,49 X1.P$8
D0
  Top 0.406: 25-32.1 79.19,57.96 PORT_D.1 79,48.27 79,47 73.6,41.6 73.6,38.1 72.53,37.03 TOP_FRC.1
D1
  Top 0.406: 25-32.2 81.73,57.96 PORT_D.2 81.5,48.23 81.5,47.5 76.1,42.1 76.1,38.1 75.03,37.03 TOP_FRC.3
D2
  Top 0.406: 25-32.3 84.27,57.96 PORT_D.3 84.27,46.47 78.7,40.9 78.7,37.7 78,37 77.42,37 TOP_FRC.5
D3
  Top 0.406: 25-32.4 86.81,57.96 PORT_D.4 87,48.27 87,47.5 81.2,41.7 81.2,38.2 80.03,37.03 TOP_FRC.7
D4  (via drill 0.6)
  Top 0.406: PORT_D.5 89.35,57.94 25-32.5 89,58.29 89,60 88.5,60.5 66,60.5 65.2,59.7 65.2,55 v65.3,54.9 | v60.1,106.2 v60.1,90 | v60.1,82.9 v60.1,68.2
  Bottom 0.406: v60.1,106.2 60.1,114.6 62.98,117.48 75.48,117.48 76.5,118.5 80,118.5 81,117.5 96.5,117.5 98,116 103,116 105,118 114.12,118 SHOOTING_FRC.2 | v65.3,54.9 64.4,54 57,54 54.2,56.8 54.2,65.7 55,66.5 59,66.5 60.1,67.6 v60.1,68.2 | v60.1,90 v60.1,82.9
D5
  Top 0.406: 25-32.6 91.87,49.97 PORT_D.6
  Bottom 0.406: PORT_D.6 91.89,48.14 91.87,48.13 94,46 127,46 129.5,48.5 134.5,48.5 137.5,51.5 137.5,79.5 140.5,82.5 140.5,109 132.8,116.7 117.5,116.7 116.68,117.52 SHOOTING_FRC.4
D6
  Top 0.406: PORT_D.7 94.43,57.94 25-32.7
  Bottom 0.406: SHOOTING_FRC.11 127,115.28 127,115 129.5,112.5 130.5,112.5 139,104 139,83.5 136,80.5 136,52.5 133.5,50 129,50 126.5,47.5 102,47.5 98.5,51 96,51 94.43,49.43 PORT_D.7
D7  (via drill 0.6)
  Top 0.406: PORT_D.8 96.97,57.96 25-32.8 97,58 100,58 101,57 v101,54.5 | SHOOTING_FRC.14 130.52,117.98 131.1,117.4 131.1,114.1 130.5,113.5 128.5,113.5 126.5,111.5 119.5,111.5 117.5,109.5 117.5,99.4 v118,98.9 | v120.9,96 132,96 133,95 133,88.5 126,81.5 v126,80.5 | v126.5,55 126.5,51.5 v125,50
  Bottom 0.406: v126,80.5 126,55.5 v126.5,55 | v125,50 105,50 101,54 v101,54.5 | v120.9,96 v118,98.9
E0  (via drill 0.6)
  Top 0.406: 46,95.7 56.84,95.7 1-8.2 | v50.5,110.36 50.5,109.5 49.5,108.5 49.5,99.2 46,95.7 | PORT_E.1 44,93.7 46,95.7
  Bottom 0.406: v50.5,110.36 50.5,116.07 54.05,119.62 54.05,121.45 CP2102.2
E1  (via drill 0.6)
  Top 0.406: 56.84,93.16 1-8.3 45.44,93.14 43.46,91.16 PORT_E.2 | v47.4,110.34 47.4,101.9 42.1,96.6 v42.1,96.2
  Bottom 0.406: v42.1,96.2 42.1,92.4 40.86,91.16 PORT_E.2 | CP2102.3 51.69,120.86 47.41,116.58 v47.41,110.35 v47.4,110.34
E2
  Top 0.406: PORT_E.3 43.12,88.62 45.1,90.6 1-8.4
  Bottom 0.406: ENCODER_L.4 34.89,94.91 36.15,93.65 36.15,89.99 37.52,88.62 PORT_E.3
E3  (via drill 0.6)
  Top 0.406: v89.5,104.5 86.5,104.5 85.5,103.5 85.5,98.5 75.06,88.06 1-8.5 56.84,88.08 44.78,88.08 42.78,86.08 PORT_E.4
  Bottom 0.406: v89.5,104.5 101,104.5 105,108.5 113.5,108.5 122.5,99.5 124.15,99.5 BASE_FRC.10
E4  (via drill 0.6)
  Top 0.406: PORT_E.5 42.14,83.54 44.12,85.52 1-8.6 77.52,85.52 90.6,98.6 90.6,102.1 v92,103.5
  Bottom 0.406: v92,103.5 102,103.5 105.5,107 113,107 123,97 124.19,97 BASE_FRC.8
E5  (via drill 0.6)
  Top 0.406: 56.82,83 1-8.7 | 64.48,82.98 v64.5,83 63.4,84.1 59.1,84.1 57.98,82.98 1-8.7 | v57.5,111.5 59,111.5 62.6,107.9 62.6,98.6 66,95.2 v66,93.6 | v126,120 126,119.3 125.6,118.9 125.6,116.1 125,115.5 124.36,115.5 SHOOTING_FRC.9 | 1-8.7 43.18,82.98 41.2,81 PORT_E.6
  Bottom 0.406: v64.5,83 65,83 66,84 v66,93.6 | v57.5,111.5 57,111.5 56,112.5 56,117 65.5,126.5 99,126.5 99.5,127 123.5,127 126,124.5 v126,120
E6
  Top 0.406: 1-8.8 43.64,80.44 41.66,78.46 PORT_E.7 37.84,78.46 36.15,80.15 36.15,81.75 36.4,82 36.4,82.6 36.15,82.85 36.15,91.45 35.23,92.37 ENCODER_L.3
E7
  Top 0.406: 9-16.1 44.4,77.9 42.42,75.92 PORT_E.8 37.78,75.92 36.21,77.49 36.21,77.86 34.29,79.78 ENCODER_R.3
F0
  Top 0.406: 57-64.5 66.42,110.4 PORT_F.1
  Bottom 0.406: TOP_FRC.2 69.43,39.57 59,50 55,50 51,54 51,99 56,104 64.42,104 66.42,102 57-64.5
F1
  Top 0.406: PORT_F.2 57-64.4
  Bottom 0.406: 57-64.4 69,100.38 69,99 66.9,96.9 53.9,96.9 53,96 53,54.5 55.5,52 64,52 74.85,41.15 TOP_FRC.4
F2
  Top 0.406: 57-64.3 71.5,110.4 PORT_F.3 71.5,112 70,113.5 47,113.5 44,110.5 44,105.5 39.5,101 21.5,101 18.92,103.58 FRONT_SENSOR.2
F3
  Top 0.406: 57-64.2 PORT_F.4 74,110.45 74,112.5 71.5,115 45,115 41,111 38,111 36.92,109.92 BACK_SENSOR.2
F4
  Top 0.406: 57-64.1 76.58,110.4 PORT_F.5
  Bottom 0.406: 57-64.1 76.58,103.5 75.08,105 55,105 49.5,99.5 49.5,54 46.5,51 41,51 39,49 34,49 31.19,51.81 X1.P$10
F5  (via drill 0.6)
  Top 0.406: PORT_F.6 49-56.8 | 49-56.8 | 49-56.8 79.11,94.11 74.5,89.5 v71.5,89.5 | v43.8,81.5 54.1,81.5 v54.3,81.7
  Bottom 0.406: v71.5,89.5 70.5,89.5 70,89 70,83 68.7,81.7 v54.3,81.7 | ENCODER_R.4 34.24,82.26 40.81,82.26 41.57,81.5 v43.8,81.5
F6  (via drill 0.6)
  Top 0.406: 49-56.7 81.66,110.4 PORT_F.7 | v101,115 103,113 107,113 107.5,113.5 107.5,115.5 108.7,116.7 117.94,116.7 SHOOTING_FRC.6
  Bottom 0.406: v101,115 92.5,115 91,116.5 83,116.5 81.65,115.15 PORT_F.7
F7  (via drill 0.6)
  Top 0.406: 49-56.6 PORT_F.8 84.5,110.73 84.5,113.5 83,115 79.5,115 74.5,120 v74,120 | SHOOTING_FRC.8 119.74,120 114,120 113,119 v106,119
  Bottom 0.406: v106,119 103.8,119 102,117.2 98,117.2 96.5,118.7 83.3,118.7 82.8,119.2 82.8,123.2 81.5,124.5 77,124.5 74,121.5 v74,120
G0  (via drill 0.6)
  Top 0.406: v129.5,78 129.5,81.5 136.5,88.5 136.5,111 139,113.5 139,121 135.5,124.5 v107,124.5 | PS2.1 99.33,113.17 100,112.5 100,110.46 PORT_G.1
  Bottom 0.406: v129.5,78 129.5,52 126.5,49 103,49 101.7,50.3 101.7,51.8 99.4,54.1 99.4,59.69 33-40.1 | PS2.1 102.9,124.5 v107,124.5
G1  (via drill 0.6)
  Top 0.406: v128,80 128,82 135,89 135,111 137,113 137,119.5 133.5,123 v121,123 | PORT_G.2 97.51,118.99 97,119.5 97,120.72 PS2.2
  Bottom 0.406: 33-40.2 100.84,62.66 110.5,53 126.5,53 128,54.5 v128,80 | v121,123 105.2,123 100.7,118.5 98,118.5 96.79,119.71 PS2.2 97,120.72 97,119.5
G2
  Top 0.406: 41-48.3 95.98,85.52 93.1,88.4 93.1,102.75 93.15,102.8 94.97,105.12 PORT_G.3 95,110.44 95,114 92.5,116.5 87.5,116.5 86.63,117.37 PS2.6
G3
  Top 0.406: PORT_G.4 92.43,113.07 90.5,115 86.5,115 84.5,117 84.5,120.52 PS2.7
  Bottom 0.406: 17-24.2 61.5,58.05 61.5,64.5 79,82 79,92 85.5,98.5 85.5,108.5 86,109 86,113 88,115 90.43,115 92.43,113 PORT_G.4
G4  (via drill 0.6)
  Top 0.406: v97,108 104.5,108 v108.5,112 | v125.6,114.1 127.5,114.1 128.1,114.7 128.1,116.3 126.84,117.56 SHOOTING_FRC.12
  Bottom 0.406: 17-24.3 63.94,63.94 81.5,81.5 81.5,91.5 88,98 88,105.5 90,107.5 90,108.2 | PORT_G.5 90,110.3 90,108.2 | 90,108.2 96.8,108.2 v97,108 | v108.5,112 123.5,112 v125.6,114.1
GND  (via drill 0.6)
  Top 0.406: TOP_FRC.9 81.5,36.06 v81.5,30.1 | v63,91.8 61.34,93.46 57-64.7 61.45,100.52 61.45,107.1 58.55,110 v54,110 | v63,111.4 64.3,110.1 64.3,106.4 65.17,105.53 65.16,105.52 65.16,98.02 67.28,95.9 v70.8,95.9 | v37.7,72.6 36.2,74.1 36.2,75.6 34.56,77.24 ENCODER_R.2 | 49-56.5 86.74,98.26 87,98 87,97.5 v76.8,87.3
  Bottom 0.406: C8.- 81.5,26 v81.5,30.1 | BASE_FRC.14 124.47,105.97 125,106.5 133.5,106.5 138,102 138,84.73 RESISTOR_PACK.1 | 17-24.6 71.56,62.56 v76.7,67.7 | ENCODER_R.2 32.56,77.24 30.7,78.9 30.8,88.2 32.83,89.83 32.47,89.83 30.9,90.9 30.9,95.9 32.7,97.3 36.1,97.3 v36.9,96.5
  other vias: 76,53 106,53 110,59 39,104 45,103 29,110 92.5,67.8 84.8,63.9 66.1,77.4 69.2,120.3 120.3,109.1 118.6,94.5 98.7,52.8 50.2,51.1 30.1,98.8 32.1,53.1 34.4,107.5 76,115 85.5,123.51
  pour Top (isolate 1.016): 149,132 149,0 0,0 0,132
  pour Bottom (isolate 1.016): 150,132 149,0 0,0 0.04,132.27
N$1
  Top 0.406: LED_PACK.11 126.53,78.47 129,76 RESISTOR_PACK.2
N$2
  Top 0.406: LED_PACK.12 125.93,75.93 126,76 128.5,73.5 131.79,73.5 RESISTOR_PACK.3
N$4
  Top 0.406: LED_PACK.13 125.61,73.39 128,71 131.75,71 RESISTOR_PACK.4
N$5
  Top 0.406: LED_PACK.14 126.15,70.85 128.6,68.4 RESISTOR_PACK.5
N$6
  Top 0.406: LED_PACK.15 126.89,68.31 129.4,65.8 131.77,65.8 RESISTOR_PACK.6
N$7
  Top 0.406: LED_PACK.16 127.13,65.77 129.6,63.3 RESISTOR_PACK.7
N$9
  Top 0.406: LED_PACK.17 126.27,63.23 129,60.5 131.55,60.5 RESISTOR_PACK.8
N$11
  Top 0.406: LED_PACK.18 126.31,60.69 129,58 131.59,58 RESISTOR_PACK.9
N$12
  Top 0.406: LED_PACK.19 126.35,58.15 129,55.5 131.63,55.5 RESISTOR_PACK.10
N$13
  Top 0.406: 4.6K.1 123.75,55.48 LED_PACK.20
N$14
  Bottom 0.813: POWER_USB.1 17.47,6.35 5V_SWITCH.4 5V_SWITCH.1
N$15
  Top 0.813: 5V_SWITCH.2 5V_SWITCH.5 24.95,4.05 26.5,2.5 31,2.5 33.73,5.23 5V-FUSE.2
N$17
  Bottom 1.422: X4.2 X4.1 X5.2 X5.1 10.27,28.77 6.5,25 6.5,23 7.75,21.75 12V_SWITCH.2 12V_SWITCH.5
N$18
  Bottom 1.422: 12V_SWITCH.1 12V_SWITCH.4 16.34,24.85 12V-FUSE.2
N$19
  Top 0.813: 5V-FUSE.1 59.08,8.66 D1.A 59.06,20.51 D2.A
VCC  (via drill 0.6)
  Top 0.406: 52.8,33.23 D2.C | 57-64.8 57.98,100.42 v51.8,106.6
  Top 0.61: \..1 122,16 | 122,16 \..2 124.5,16 | 124.5,16 \..3 | \..3 129.5,16 | 129.5,16 \..4 \..5 132.08,19.31 5V.5 | 129.5,19.5 129.5,16 | 127,19.5 \..3 | 124.5,19.5 124.5,16 | 121.5,19.5 122,19.5 122,16
  Top 0.813: 52.8,33.23 D1.C | D1.C 60.04,33.23 C1.+ | C1.+ 67.27,20.73 7805_1.OUT | C1.+ 67.27,26.27 71,30 79,30 80.5,28.5 81.77,28.5 C8.+ | C8.+ 84.27,20.23 7805_2.OUT | 7805_3.OUT 101.46,25.81 C7.+ | C8.+ 88.27,30 97.27,30 | C7.+ 105.77,30.5 109.5,30.5 114,26 114,21.5 115.93,19.57 5V.1 5V.2 5V.3 5V.4 5V.5 | 97.27,30 C7.+ | TOP_FRC.15 TOP_FRC.13 90.24,37.03 90.64,36.63 | 90.64,36.63 97.27,30 | 90.64,36.63 96.5,42.5 96.5,43.5 103,50 110.5,50 113.5,53 113.5,56.5 115.15,58.15 LED_PACK.2 | DIGI_1.1 22.03,36.22 DIGI_2.1 43.53,36.22 DIGI_3.1 | DIGI_3.1 56.87,38.69 DIGI_4.1 | DIGI_4.1 57,35.31 D1.C | 17-24.5 69.02,45.02 62.5,38.5 57.06,38.5 DIGI_4.1 | DIGI_3.1 44.31,38.69 34.1,48.9 v34.1,56.5 | X1.P$15 X1.P$16 28.22,68.26 28.22,68.28 26.9,69.6 26.9,73.22 R3.1 29.52,74.74 | 1K.1 27.48,83.52 29.5,81.5 29.5,76 29.52,74.74 | 1K.1 25.78,83 18.5,83 16.8,84.7 R5.1 16.44,82.56 17.5,81.5 17.5,74.54 R2.1 | v92.5,107 90.8,105.3 90.8,103.8 89.28,102.28 49-56.4 | BACK_SENSOR.9 45.05,125.5 87.5,125.5 89.17,123.83 PS2.5 89.17,121.67 92,124.5 103,124.5 106,121.5 130.5,121.5 132.5,119.5 132.5,112.5 128.5,108.5 123,108.5 121.5,107 121.5,103.5 122.64,102.36 BASE_FRC.12 | ENCODER_R.1 30.22,74.7 29.52,74.74 | 1K.1 30.3,84.7 31.7,86.1 32.94,86.1 ENCODER_L.1
  Bottom 0.406: 57-64.8 58.8,99.4 60.2,98 63.2,98 64,98.8 64,100.3 57-64.6 | v51.8,106.6 46.8,106.6 42.8,110.6 42.8,112.7 40.6,114.9 39.53,114.9 BACK_SENSOR.5
  Bottom 0.813: X1.P$15 31.49,64.51 32.5,63.5 32.5,59.6 34.1,58 v34.1,56.5 | FRONT_SENSOR.5 FRONT_SENSOR.7 FRONT_SENSOR.9 | FRONT_SENSOR.9 21.46,116.04 20,117.5 14,117.5 11.5,115 11.5,86.5 13.3,84.7 R5.1 | FRONT_SENSOR.9 29.84,123 37,123 39.46,120.54 BACK_SENSOR.9 BACK_SENSOR.7 BACK_SENSOR.5 | BASE_FRC.12 122.64,102.36 114.5,110.5 105.5,110.5 101,106 93.5,106 v92.5,107

### Text on the board
tNames: ROBOCON 2017 | TX | RX | 0 | 7 | 4 | 0 | 0 | 0 | 7 | 7 | 7 | 0 | 0 | VCC | 12V | 7 | 0 | 7 | SOCIETY OF ROBOTICS AND AUTOMATION